# Altium schematic sheet USB-C.SchDoc
size A4; SheetNumber: 5; SheetTotal: 7
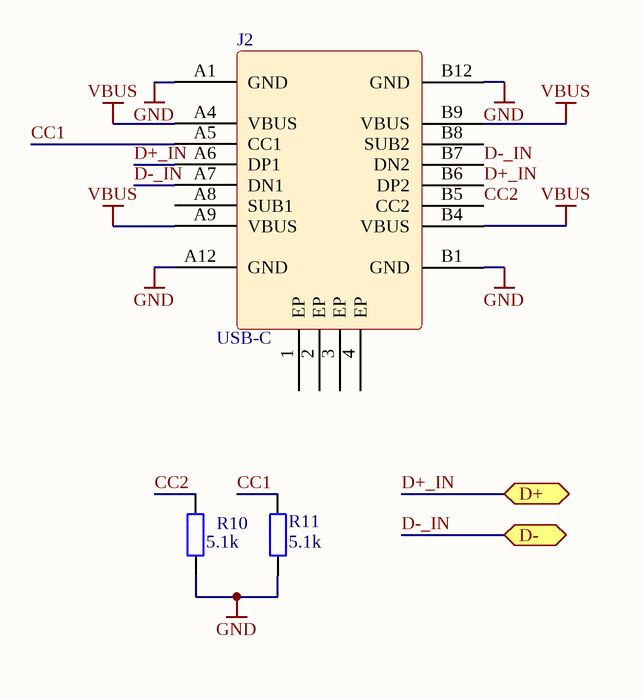
[diagram p0: USB-C.SchDoc]

## Parts
J2  USB-C  [USB-C_1]
R10  5.1k  [0402_RES]
R11  5.1k  [0402_RES]

## Ports
D+ (bidir, see Smart-Watch-Front[3C], USB-UART[2A]), D- (bidir, see Smart-Watch-Front[3C], USB-UART[2A])

## Nets
GND: J2.A1(GND) J2.A12(GND) J2.B1(GND) J2.B12(GND) R10.1 R11.1
VBUS: J2.A4(VBUS) J2.A9(VBUS) J2.B4(VBUS) J2.B9(VBUS)
CC1: J2.A5(CC1) R11.2
CC2: J2.B5(CC2) R10.2
D+_IN: J2.A6(DP1) J2.B6(DP2) ; port D+
D-_IN: J2.A7(DN1) J2.B7(DN2) ; port D-

Not connected (* = marked no-connect by the designer): J2 1(EP) 2(EP) 3(EP) 4(EP) A8(SUB1) B8(SUB2)

## Library data of the parts
J2 = USB-C_1
R10 R11 = R